# EAGLE design BusPirate-v3.6a (EAGLE 7.4.0)
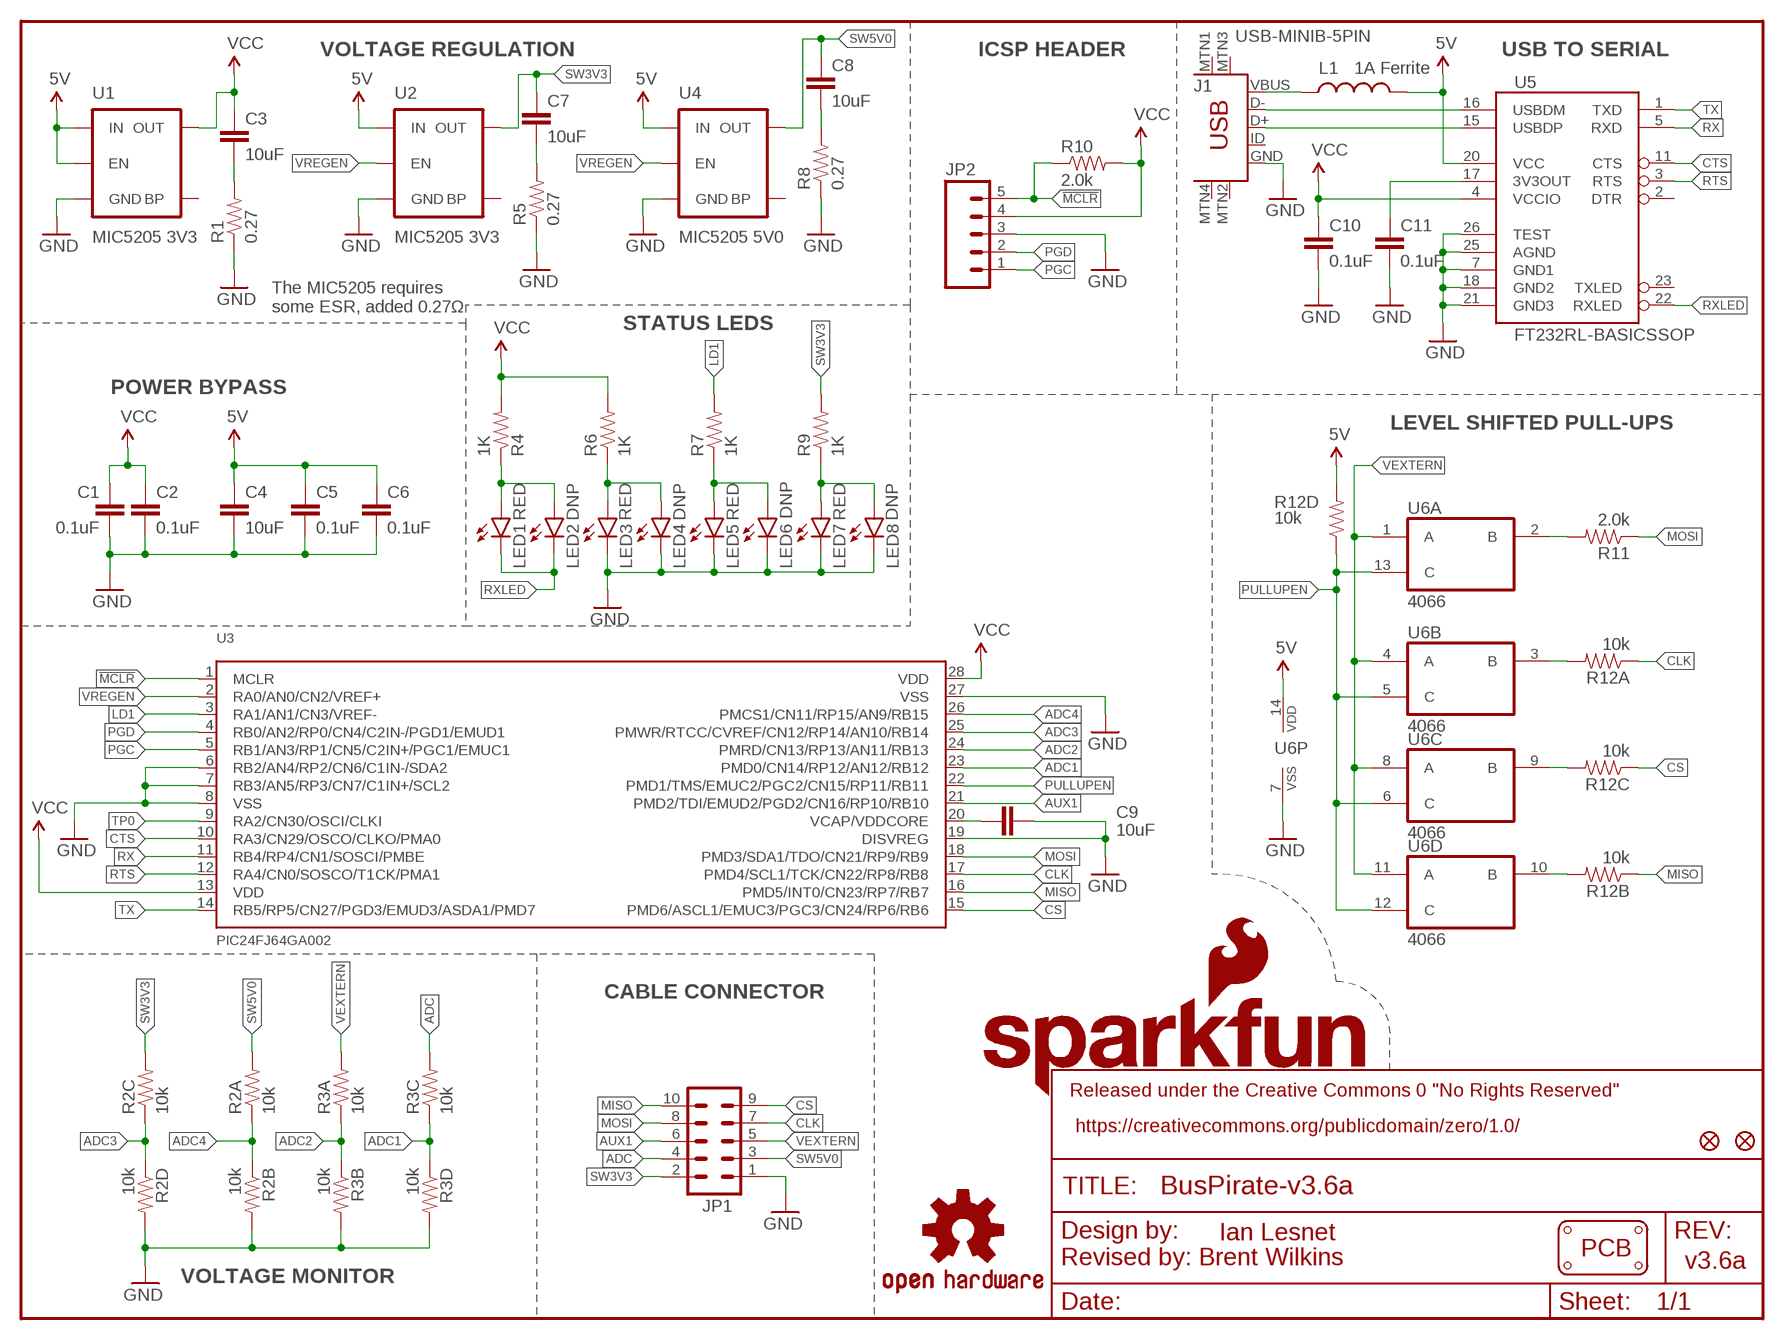
[diagram p0: schematic, sheet 1]

## Parts
C1  0.1uF  0.1UF-25V(+80/-20%)(0603)  [0603-CAP]
C2  0.1uF  0.1UF-25V(+80/-20%)(0603)  [0603-CAP]
C3  10uF  10UF10V10%(0805)  [0805-CAP]
C4  10uF  10UF10V10%(0805)  [0805-CAP]
C5  0.1uF  0.1UF-25V(+80/-20%)(0603)  [0603-CAP]
C6  0.1uF  0.1UF-25V(+80/-20%)(0603)  [0603-CAP]
C7  10uF  10UF10V10%(0805)  [0805-CAP]
C8  10uF  10UF10V10%(0805)  [0805-CAP]
C9  10uF  10UF10V10%(0805)  [0805-CAP]
C10  0.1uF  0.1UF-25V(+80/-20%)(0603)  [0603-CAP]
C11  0.1uF  0.1UF-25V(+80/-20%)(0603)  [0603-CAP]
FID1  FIDUCIAL1X2  [FIDUCIAL-1X2]
FID2  FIDUCIAL1X2  [FIDUCIAL-1X2]
J1  USB-MINIB-5PIN  [USB-MINIB]
JP1  M05X2SHD_SMD  [2X5-SHROUDED_SMD]
JP2  M05PTH  [1X05]
L1  1A Ferrite  INDUCTOR0603  [0603]
LED1  RED  LED-RED0603  [LED-0603]
LED2  DNP  LED-RED0603  [LED-0603]
LED3  RED  LED-RED0603  [LED-0603]
LED4  DNP  LED-RED0603  [LED-0603]
LED5  RED  LED-RED0603  [LED-0603]
LED6  DNP  LED-RED0603  [LED-0603]
LED7  RED  LED-RED0603  [LED-0603]
LED8  DNP  LED-RED0603  [LED-0603]
LOGO1  OSHW-LOGOL  [OSHW-LOGO-L]
LOGO2  SFE_LOGO_NAME_FLAME.1_INCH  [SFE_LOGO_NAME_FLAME_.1]
PCB1  PCB_DP_RECTANGLE-37X60  [DP6037_V1]
R1  0.27  0OHM-1/10W-5%(0603)  [0603]
R2  10k  CAY16-F4  [4XARRAY]
R3  10k  CAY16-F4  [4XARRAY]
R4  1K  1KOHM-1/10W-1%(0603)  [0603-RES]
R5  0.27  0OHM-1/10W-5%(0603)  [0603]
R6  1K  1KOHM-1/10W-1%(0603)  [0603-RES]
R7  1K  1KOHM-1/10W-1%(0603)  [0603-RES]
R8  0.27  0OHM-1/10W-5%(0603)  [0603]
R9  1K  1KOHM-1/10W-1%(0603)  [0603-RES]
R10  2.0k  2.0KOHM1/10W5%(0603)  [0603-RES]
R11  2.0k  2.0KOHM1/10W5%(0603)  [0603-RES]
R12  10k  CAY16-F4  [4XARRAY]
U1  MIC5205 3V3  MIC52053.3V  [SOT23-5]
U2  MIC5205 3V3  MIC52053.3V  [SOT23-5]
U3  PIC24FJ64GA002  [SSOP28]
U4  MIC5205 5V0  MIC52055V  [SOT23-5]
U5  FT232RL-BASICSSOP  [SSOP28DB]
U6  4066  [TSSOP14]

## Nets
5V: C4.1 C5.1 C6.1 L1.2 R12.5 U1.1(IN) U1.3(EN) U2.1(IN) U4.1(IN) U5.20(VCC) U6.14(P:VDD)
!MCLR: JP2.5 R10.1 U3.1(MCLR)
$N26: J1.VBUS L1.1
ADC: JP1.4 R3.6
ADC1: R3.3 R3.4 U3.23(PMD0/CN14/RP12/AN12/RB12)
ADC2: R3.1 R3.2 U3.24(PMRD/CN13/RP13/AN11/RB13)
ADC3: R2.3 R2.4 U3.25(PMWR/RTCC/CVREF/CN12/RP14/AN10/RB14)
ADC4: R2.1 R2.2 U3.26(PMCS1/CN11/RP15/AN9/RB15)
AUX1: JP1.6 U3.21(PMD2/TDI/EMUD2/PGD2/CN16/RP10/RB10)
CLK: JP1.7 R12.1 U3.17(PMD4/SCL1/TCK/CN22/RP8/RB8)
CS: JP1.9 R12.3 U3.15(PMD6/ASCL1/EMUC3/PGC3/CN24/RP6/RB6)
CTS: U3.10(RA3/CN29/OSCO/CLKO/PMA0) U5.11(CTS)
D+: J1.D+ U5.15(USBDP)
D-: J1.D- U5.16(USBDM)
GND: C1.2 C2.2 C4.2 C5.2 C6.2 C9.2 C10.2 C11.2 J1.GND JP1.1 JP2.3 LED3.C LED4.C LED5.C LED6.C LED7.C LED8.C R1.1 R2.5 R2.7 R3.5 R3.7 R5.1 R8.1 U1.2(GND) U2.2(GND) U3.6(RB2/AN4/RP2/CN6/C1IN-/SDA2) U3.7(RB3/AN5/RP3/CN7/C1IN+/SCL2) U3.8(VSS) U3.19(DISVREG) U3.27(VSS) U4.2(GND) U5.7(GND1) U5.18(GND2) U5.21(GND3) U5.25(AGND) U5.26(TEST) U6.7(P:VSS)
LD1: R7.2 U3.3(RA1/AN1/CN3/VREF-)
MISO: JP1.10 R12.2 U3.16(PMD5/INT0/CN23/RP7/RB7)
MOSI: JP1.8 R11.1 U3.18(PMD3/SDA1/TDO/CN21/RP9/RB9)
N$1: R11.2 U6.2(A:B)
N$2: R12.6 U6.9(C:B)
N$3: C9.1 U3.20(VCAP/VDDCORE)
N$4: R12.7 U6.10(D:B)
N$5: R12.8 U6.3(B:B)
N$6: LED5.A LED6.A R7.1
N$7: LED3.A LED4.A R6.1
N$8: C3.2 R1.2
N$9: C11.1 U5.17(3V3OUT)
N$10: C7.2 R5.2
N$11: C8.2 R8.2
N$13: LED1.A LED2.A R4.1
N$18: LED7.A LED8.A R9.1
PGC: JP2.1 U3.5(RB1/AN3/RP1/CN5/C2IN+/PGC1/EMUC1)
PGD: JP2.2 U3.4(RB0/AN2/RP0/CN4/C2IN-/PGD1/EMUD1)
PULLUPEN: R12.4 U3.22(PMD1/TMS/EMUC2/PGC2/CN15/RP11/RB11) U6.5(B:C) U6.6(C:C) U6.12(D:C) U6.13(A:C)
RTS: U3.12(RA4/CN0/SOSCO/T1CK/PMA1) U5.3(RTS)
RX: U3.11(RB4/RP4/CN1/SOSCI/PMBE) U5.5(RXD)
RXLED: LED1.C LED2.C U5.22(RXLED)
SW3V3: C7.1 JP1.2 R2.6 R9.2 U2.5(OUT)
SW5V0: C8.1 JP1.3 R2.8 U4.5(OUT)
TP0: U3.9(RA2/CN30/OSCI/CLKI)
TX: U3.14(RB5/RP5/CN27/PGD3/EMUD3/ASDA1/PMD7) U5.1(TXD)
VCC: C1.1 C2.1 C3.1 C10.1 JP2.4 R4.2 R6.2 R10.2 U1.5(OUT) U3.13(VDD) U3.28(VDD) U5.4(VCCIO)
VEXTERN: JP1.5 R3.8 U6.1(A:A) U6.4(B:A) U6.8(C:A) U6.11(D:A)
VREGEN: U2.3(EN) U3.2(RA0/AN0/CN2/VREF+) U4.3(EN)
Unconnected: J1.ID J1.MTN1(MTN2) J1.MTN2(MTN3) J1.MTN3(MTN1) J1.MTN4 U1.4(BP) U2.4(BP) U4.4(BP) U5.2(DTR) U5.23(TXLED)

## Notes on the sheet
- VOLTAGE REGULATION | ICSP HEADER | USB TO SERIAL
- The MIC5205 requires
  some ESR, added 0.27Ω
- STATUS LEDS
- POWER BYPASS
- LEVEL SHIFTED PULL-UPS
- CABLE CONNECTOR
- Released under the Creative Commons 0 "No Rights Reserved"
- https://creativecommons.org/publicdomain/zero/1.0/
- TITLE:
- Design by: | Ian Lesnet | REV:
- Revised by: Brent Wilkins | v3.6a
- VOLTAGE MONITOR
- Date: | Sheet:

## Library data of the parts
C1 C2 C5 C6 C10 C11 = SparkFun-Capacitors:0.1UF-25V(+80/-20%)(0603): CAP-00810 Ceramic Standard decoupling cap; PROD_ID: CAP-00810
C3 C4 C7-C9 = SparkFun-Capacitors:10UF10V10%(0805): CAP-11330; PROD_ID: CAP-11330
FID1 FID2 = SparkFun-Aesthetics:FIDUCIAL: Fiducial Alignment Points Various fiducial points for machine vision alignment.
J1 = SparkFun-Connectors:USB-MINIB: Mini-USB "B" connector with 5th pin broken out. Created new symbol breaking out 5th "ID" pin in mini/micro USB connector spec. See: http://en.wikipedia.org/wiki/Mini_usb#Cables. Uses same footprint as 4-pin symbol. Also added pins to connect to mounting / shield pads if required (probably not generally needed as signals aren't shielded once they leave the connector).; PROD_ID: CONN-08193
JP1 = SparkFun-Connectors:M05X2: Header 5x2 Standard 10-pin dual row 0.1" header. Commonly used with AVR-ISP. Use with Spark Fun Electronics SKU: PRT-00778; PROD_ID: CONN-09508
JP2 = SparkFun-Connectors:M05: Header 5 Standard 5-pin 0.1" header. Use with straight break away headers (SKU : PRT-00116), right angle break away headers (PRT-00553), swiss pins (PRT-00743), machine pins (PRT-00117), and female headers (PRT-00115). Molex polarized connector foot print use with SKU : PRT-08230 with associated crimp pins and housings.
L1 = SparkFun-Passives:INDUCTOR: Inductors Basic Inductor/Choke - 0603 and 1206. Footprints are not proven and vary greatly between part numbers. INDUCTOR POWER 3.3UH 4.0A SMD 0.197" L x 0.197" W x 0.177" H (5.00mm x 5.00mm x 4.50mm); PROD_ID: NDUC-12579
LED1 LED3 LED5 LED7 = SparkFun-LED:LED-RED: Assorted Red LEDs LilyPad 1206- DIO-09912 1206- DIO-00809 0603- DIO-00819 "SMART" means more efficient and expensive; PROD_ID: DIO-00819
LED2 LED4 LED6 LED8 = SparkFun-LED:LED-RED: Assorted Red LEDs LilyPad 1206- DIO-09912 1206- DIO-00809 0603- DIO-00819 "SMART" means more efficient and expensive; PROD_ID: DIO-00819; VALUE: RED
LOGO1 = SparkFun-Aesthetics:OSHW-LOGO: Open Source Hardware Logo This logo indicates the piece of hardware it is found on incorporates a OSHW license and/or adheres to the definition of open source hardware found here: http://freedomdefined.org/OSHW
LOGO2 = SparkFun-Aesthetics:SFE_LOGO_NAME_FLAME: SFE Logo, name and flame This is the SparkFun full logo. The logo on the schematic will always be the same size; the package variant is the height of the flame part of the logo. Default layer for the logo on the board is tSilk.
PCB1 = SparkFun-Boards:PCB_DP_RECTANGLE: Dangerous Prototypes Standard Rectangular PCB sizes
R1 R5 R8 = SparkFun-Resistors:0OHM-1/10W-5%(0603): RES-08609; PROD_ID: RES-08787; VALUE: 0
R2 R3 R12 = Testing:CAY16-F4: CAY16-F4 <http://www.bourns.com/data/global/pdfs/CATCAY.pdf>; PROD_ID: RES-13167
R4 R6 R7 R9 = SparkFun-Resistors:1KOHM-1/10W-1%(0603): RES-07856; PROD_ID: RES-07856
R10 R11 = SparkFun-Resistors:2.0KOHM1/10W5%(0603): RES-08296; PROD_ID: RES-08296
U1 U2 = SparkFun-PowerIC:MIC5205: MIC5205 150mA vreg 3.3V - VREG-00822 5V - VREG-00823; PROD_ID: VREG-00822
U3 = Testing:PIC24FJ64GA002: 16-bit General Purpose Flash Microcontroller; PROD_ID: IC-09426
U4 = SparkFun-PowerIC:MIC5205: MIC5205 150mA vreg 3.3V - VREG-00822 5V - VREG-00823; PROD_ID: VREG-00823
U5 = SparkFun-DigitalIC:FT232RL-BASIC: USB UART This is the simplified version of the FT232RL unit. Only what you need, nothing you don't. Spark Fun Electronics SKU : COM-00650; PROD_ID: IC-00870
U6 = 40xx:4066: Quad bilateral ANALOG SWITCH; PROD_ID: IC-13191

## Board
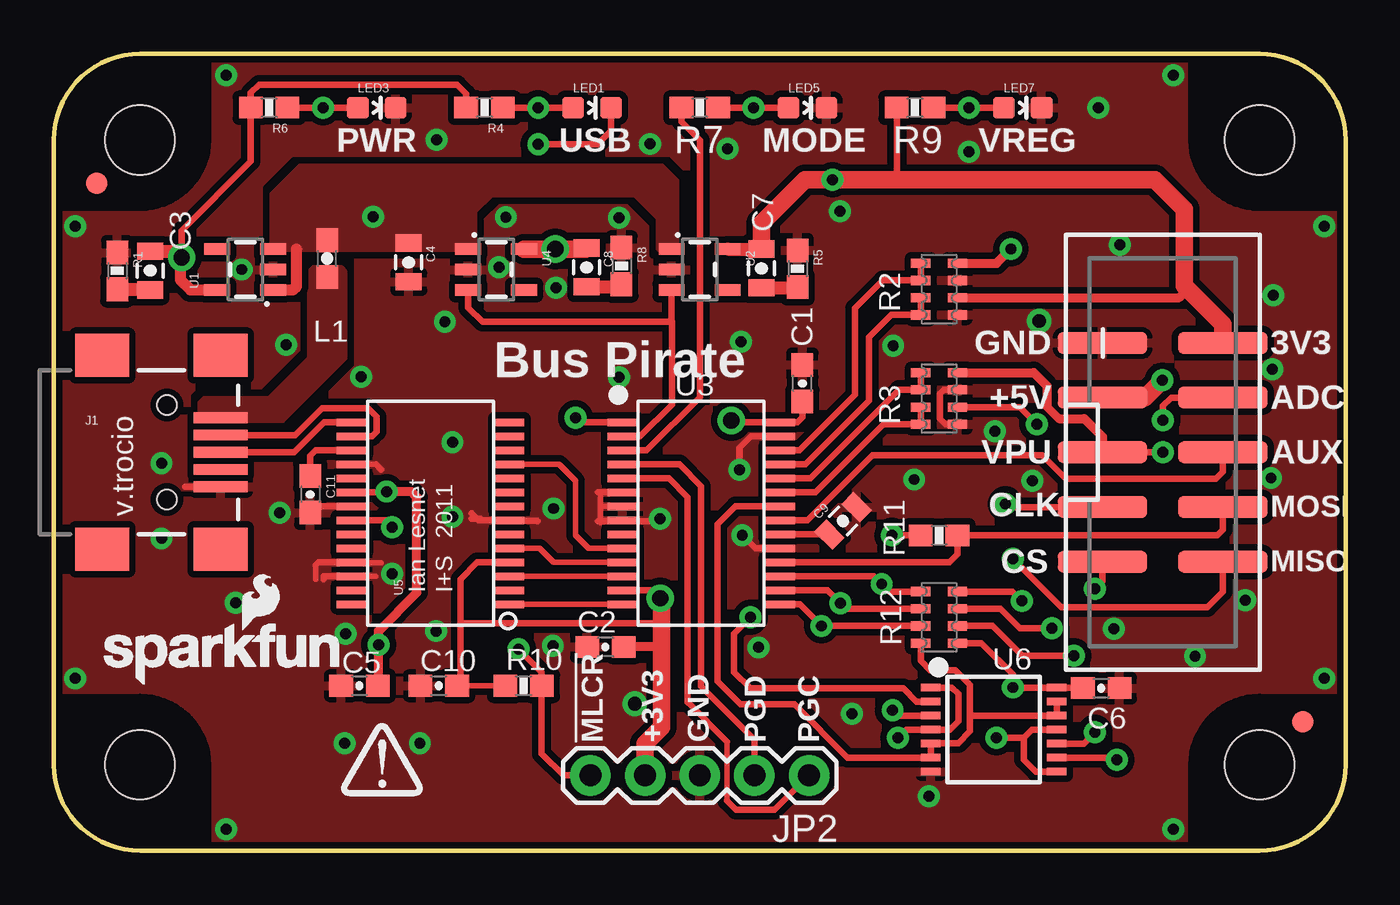
[diagram p1: board, top side]
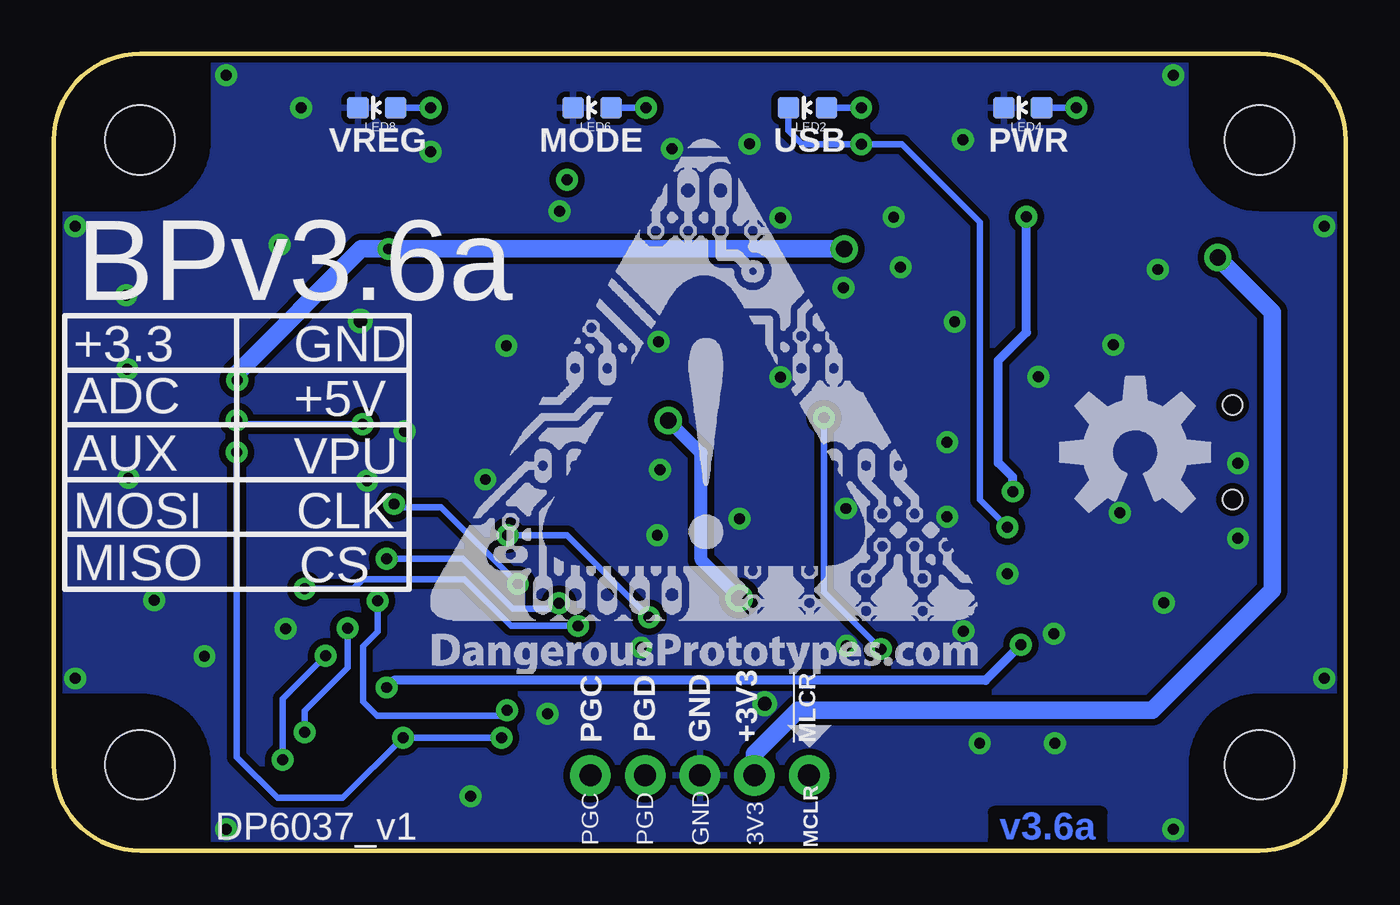
[diagram p2: board, bottom side, seen from below]

Size 60 x 37 mm. Coordinates in mm from the lower left corner, seen from the top.
Copper layers (1*16): Top 0.035mm / dielectric 1.5mm / Bottom 0.035mm
Design rules "SparkFun-2-layer *": minimum track width 7mil, minimum drill 15mil, track to track 8mil, track to pad 8mil, pad to pad 8mil, via to via 8mil, smd to smd 8mil, copper to edge 8mil, drill to drill 8mil, minimum pad ring 12mil, minimum via ring 10mil, stop-mask expansion 4mil, vias tented up to drill 30mil, thermal gap 10mil
tKeepout: 8 lines
bKeepout: 8 lines
tRestrict: area 0,30 to 7,37; area 53,30 to 60,37; area 0,0 to 7,7; area 53,0 to 60,7; area 26.1,16.2 to 26.7,16.4; area 13.6,12.9 to 14.1,13.2
bRestrict: area 0,30 to 7,37; area 53,30 to 60,37; area 0,0 to 7,7; area 53,0 to 60,7
vRestrict: area 0,30 to 7,37; area 53,30 to 60,37; area 0,0 to 7,7; area 53,0 to 60,7

### Footprints (pad centres in the part's own frame; a part is rotated, then mirrored left to right if it is on the bottom)
0603-CAP = smd 1.1 x 1: 1 -0.85,0; 2 0.85,0
0805-CAP = smd 0.8 x 1.2: 1 -0.9,0; 2 0.9,0
FIDUCIAL-1X2 = smd 1 x 1: 1 0,0
USB-MINIB = smd 2.5 x 0.5: D+ 2.5,0; D- 2.5,0.8; GND 2.5,-1.6; ID 2.5,-0.8; VBUS 2.5,1.6 | smd 2.5 x 2: MTN1 -3,4.5; MTN2 2.5,4.5; MTN3 -3,-4.5; MTN4 2.5,-4.5 | hole 0.9: 0,2.2; 0,-2.2
2X5-SHROUDED_SMD = smd 4.15 x 1: 1 -2.794,5.08; 2 2.794,5.08; 3 -2.794,2.54; 4 2.794,2.54; 5 -2.794,0; 6 2.794,0; 7 -2.794,-2.54; 8 2.794,-2.54; 9 -2.794,-5.08; 10 2.794,-5.08
1X05 = drill 1.016 pad 1.88: 1 0,0; 2 2.54,0; 3 5.08,0; 4 7.62,0; 5 10.16,0
0603 = smd 1.1 x 1: 1 -0.85,0; 2 0.85,0
LED-0603 = smd 1 x 1: A 0,-0.877; C 0,0.877
DP6037_V1 = hole 3.2: 4,4; 56,4; 56,33; 4,33
4XARRAY = smd 0.425 x 0.9: 1 -1.2,-0.85; 2 -0.4,-0.85; 3 0.4,-0.85; 4 1.2,-0.85; 5 1.2,0.85; 6 0.4,0.85; 7 -0.4,0.85; 8 -1.2,0.85
0603-RES = smd 1.1 x 1: 1 -0.85,0; 2 0.85,0
SOT23-5 = smd 0.55 x 1.2: 1 -0.95,-1.3; 2 0,-1.3; 3 0.95,-1.3; 4 0.95,1.3; 5 -0.95,1.3
SSOP28 = smd 0.348 x 1.397: 1 -4.225,-3.656; 2 -3.575,-3.656; 3 -2.925,-3.656; 4 -2.275,-3.656; 5 -1.625,-3.656; 6 -0.975,-3.656; 7 -0.325,-3.656; 8 0.325,-3.656; 9 0.975,-3.656; 10 1.625,-3.656; 11 2.275,-3.656; 12 2.925,-3.656; 13 3.575,-3.656; 14 4.225,-3.656; 15 4.225,3.656; 16 3.575,3.656; 17 2.925,3.656; 18 2.275,3.656; 19 1.625,3.656; 20 0.975,3.656; 21 0.325,3.656; 22 -0.325,3.656; 23 -0.975,3.656; 24 -1.625,3.656; 25 -2.275,3.656; 26 -2.925,3.656; 27 -3.575,3.656; 28 -4.225,3.656
SSOP28DB = smd 0.348 x 1.397: 1 -4.225,-3.656; 2 -3.575,-3.656; 3 -2.925,-3.656; 4 -2.275,-3.656; 5 -1.625,-3.656; 6 -0.975,-3.656; 7 -0.325,-3.656; 8 0.325,-3.656; 9 0.975,-3.656; 10 1.625,-3.656; 11 2.275,-3.656; 12 2.925,-3.656; 13 3.575,-3.656; 14 4.225,-3.656; 15 4.225,3.656; 16 3.575,3.656; 17 2.925,3.656; 18 2.275,3.656; 19 1.625,3.656; 20 0.975,3.656; 21 0.325,3.656; 22 -0.325,3.656; 23 -0.975,3.656; 24 -1.625,3.656; 25 -2.275,3.656; 26 -2.925,3.656; 27 -3.575,3.656; 28 -4.225,3.656
TSSOP14 = smd 0.35 x 0.9: 1 -1.95,-2.925; 2 -1.3,-2.925; 3 -0.65,-2.925; 4 0,-2.925; 5 0.65,-2.925; 6 1.3,-2.925; 7 1.95,-2.925; 8 1.95,2.925; 9 1.3,2.925; 10 0.65,2.925; 11 0,2.925; 12 -0.65,2.925; 13 -1.3,2.925; 14 -1.95,2.925

### Placement (x,y rotation side)
C1  34.77,21.7 90 top
C2  25.62,9.46 180 top
C3  4.47,26.94 270 top
C4  16.48,27.32 270 top
C5  14.19,7.66 180 top
C6  48.65,7.55 0 top
C7  32.86,27.04 270 top
C8  24.74,27.09 270 top
C9  36.65,15.32 45 top
C10  17.88,7.66 180 top
C11  11.91,16.55 270 top
FID1  2,31 0 top
FID2  58,6 0 top
J1  5.25,18.5 0 top
JP1  51.5,18.5 0 top
JP2  35.08,3.5 180 top
L1  12.7,27.5 90 top
LED1  25,34.5 270 top
LED2  25,34.5 90 bottom
LED3  15,34.5 270 top
LED4  15,34.5 90 bottom
LED5  35,34.5 270 top
LED6  35,34.5 90 bottom
LED7  45,34.5 270 top
LED8  45,34.5 90 bottom
LOGO1  9.78,18.5 0 bottom
LOGO2  1.91,7.62 0 top
PCB1  0,0 0 top
R1  2.95,26.92 270 top
R2  41.12,26.08 270 top
R3  41.12,21 270 top
R4  20,34.5 180 top
R5  34.54,27.03 270 top
R6  10,34.5 180 top
R7  30,34.5 180 top
R8  26.37,27.15 270 top
R9  40,34.5 180 top
R10  21.81,7.66 180 top
R11  41.12,14.65 180 top
R12  41.12,10.84 270 top
U1  8.89,26.99 90 top
U2  30,26.99 270 top
U3  30.07,15.66 270 top
U4  20.54,26.99 270 top
U5  17.5,15.66 90 top
U6  43.66,5.63 270 top
U$1  [DP-LOGO]  13.34,2.54 0 top
U$3  [DP_LOGO_ART_1X1]  42.49,8.24 0 bottom

### Tracks (layer width: path | path; a pad name or v marks a point on that pad's centre or on a via)
5V  (via drill 0.51)
  Top 0.305: U5.20 15.42,16.64 v15.46,16.68 | R12.5 43.08,9.64 44.53,8.19 44.53,7.59 v44.55,7.58 U6.14 47.77,7.58 C6.1
  Top 0.406: C5.1 15.08,7.7 v15.08,9.57 15.08,10.2 16.86,11.98 16.86,16.43 16.61,16.68 v15.46,16.68
  Top 0.508: U1.1 11.12,26.04 11.27,26.19 11.27,27.94
  Bottom 0.406: v15.08,9.57 16.73,7.92 44.21,7.92 v44.55,7.58 | v15.46,16.68 15.46,17.34 16.14,18.02 16.14,22.77 14.83,24.07 v14.83,29.44
  pour Top (isolate 0.203, no thermals): 10.16,30.48 10.16,27.94 19.53,27.94 19.53,29.69 20.32,30.48 26.99,30.48 28.1,29.37 28.1,27.94 28.89,27.94 28.89,31.11 28.26,31.75 11.43,31.75
!MCLR  (via drill 0.51)
  Top 0.305: U3.1 24.45,19.89 v24.23,20.11 | JP2.5 23.67,3.5 22.66,4.51 R10.1 22.66,8.29 v21.59,9.37
  Bottom 0.305: v24.23,20.11 24.23,12 v21.59,9.37
$N26
  pour Top (isolate 0.305, no thermals): 6.83,20 6.83,20.8 6.99,20.95 10,20.95 11.91,22.86 11.91,26.89 12.06,27.05 13.34,27.05 13.49,26.89 13.49,22.86 10.64,20
ADC  (via drill 0.51)
  Top 0.305: R3.6 44.87,20.6 v45.66,19.8 | v51.51,19.99 51.51,20.65 51.9,21.04 JP1.4
  Bottom 0.305: v45.66,19.8 51.32,19.8 v51.51,19.99
ADC1
  Top 0.305: R3.3 R3.4 38.54,19.8 35.38,16.64 U3.23
ADC2
  Top 0.305: R3.1 R3.2 39.25,21.4 35.14,17.29 U3.24
ADC3
  Top 0.305: R2.3 R2.4 38.9,24.88 37.85,23.83 37.85,20.89 34.91,17.94 U3.25
ADC4
  Top 0.305: U3.26 34.64,18.59 37.22,21.16 37.22,25.18 38.52,26.48 R2.2 R2.1
AUX1
  Top 0.305: U3.21 35,15.34 38.02,18.36 45.91,18.36 47,17.27 53.97,17.27 54.29,17.59 JP1.6
CLK  (via drill 0.51)
  Top 0.305: U3.17 38.1,12.74 v38.45,12.39 | v38.45,12.39 38.7,12.13 | R12.1 38.8,12.04 v38.45,12.39 | v44.2,16.1 44.34,15.96 JP1.7
  Bottom 0.305: v38.45,12.39 42.02,15.96 44.06,15.96 v44.2,16.1
CS  (via drill 0.51)
  Top 0.305: v35.66,10.44 R12.3 | v35.66,10.44 35.8,10.44 | v35.66,10.44 34.66,11.44 U3.15 | v48.35,12.16 48.71,12.52 JP1.9
  Bottom 0.305: v35.66,10.44 38.76,10.44 40.94,12.62 45.64,12.62 46.09,12.16 v48.35,12.16
CTS
  Top 0.254: U5.11 23.48,17.94 24.23,17.19 24.23,14.65 24.84,14.04 U3.10
D+
  Top 0.305: U5.15 12.55,19.89 11.93,19.26 11.92,19.26 11.16,18.5 J1.D+
D-
  Top 0.305: 13.85,19.25 U5.16 14.79,19.24 15,19.45 15,20.15 14.6,20.55 12.45,20.55 11.2,19.3 J1.D-
GND  (via drill 0.51, 0.64)
  Top 0.254: 14.97,17.94 U5.18 | 12.16,12.62 12.16,13.25 | 13.69,13.38 15.21,13.38 | 14.96,12.74 13.81,12.74 13.82,12.74 U5.26 | U3.6 25.4,16.64 25.4,15.34 | U3.8 25.4,15.34 | 25.4,15.34 25.4,15.24 | U3.7 25.4,15.99 25.4,15.34
  Top 0.305: 19.73,15.34 19.8,15.41 19.65,15.41 | 19.65,15.41 19.4,15.41 | 19.73,15.34 U5.7 | 19.65,15.41 19.4,15.66 | 19.65,15.41 19.73,15.34 | 15.21,17.7 14.97,17.94 | U5.25 12.3,13.39 12.16,13.25 | U5.26 12.54,12.74 12.54,12.62 | v31.85,17.7 31.85,18.71 32.37,19.24 U3.27 33.6,19.24 | U3.19 32.58,14.04 v31.97,14.65 | 25.27,15.31 28.06,15.31 | 20.92,15.33 22.45,15.33 22.47,15.31 | U5.21 12.19,15.99 C11.2 | J1.GND 6.1,16.9 | R3.5 41.42,19.8 41.15,20.07 41.15,21.21 41.34,21.4 R3.7 | U3.6 25.27,16.64
  other vias: 20.67,27.09 8.73,26.99 8,1 13.5,5 17,5 1,8 52,1 59,8 55.34,11.62 56.53,17.31 56.59,22.36 56.64,25.8 59,29 49.5,28.13 36.51,29.69 42.5,32.45 52,36 31.29,32.59 17.78,33.02 18.51,18.96 18.51,15.51 17.75,10.2 13.56,10.07 8.45,11.52 10.48,15.69 10.79,23.5 14.27,22.01 32.73,9.44 15.72,12.87 53,9.03 40.64,2.54 45.45,17.19 49.23,10.3 43.7,19.47 23.21,15.89 28.16,15.41 37.06,6.37 38.98,23.45 31.92,23.63 26.26,21.99 1,29 8,36 48.51,34.5 45.77,24.6 26.99,6.83 18.16,24.55 23.33,26.14 26.26,29.39 20.99,29.42 23.18,9.53 5,14.5 5,18 27.69,32.82 39.96,17.24
  pour Top (isolate 0.305, rank 6): 0,37 60,37 60,0 0,0
  pour Bottom (isolate 0.305): 0,37 60,37 60,0 0,0
LD1
  Top 0.305: U3.3 27.53,18.59 30,21.06 30,33 29.15,33.85 R7.2
MISO  (via drill 0.51)
  Top 0.305: U3.16 35.93,12.09 v36.53,11.49 | v36.53,11.49 36.42,11.6 | v36.53,11.49 36.78,11.24 R12.2 | JP1.10 54.29,12.02 53.57,11.3 46.79,11.3 v44.54,13.55
  Bottom 0.305: v36.53,11.49 36.78,11.24 38.67,11.24 40.98,13.55 v44.54,13.55
MOSI
  Top 0.305: U3.18 41.59,13.39 41.97,13.77 R11.1 54.05,14.65 54.3,14.9 JP1.8
N$1  (via drill 0.51)
  Top 0.305: v38.93,14.65 R11.2 | U6.2 40.07,6.93 39.47,7.54 32.35,7.54 31.59,8.3 31.59,10.07 v32.35,10.84
  Bottom 0.305: v38.93,14.65 36.16,14.65 v32.35,10.84
N$2  (via drill 0.51)
  Top 0.305: U6.9 49.27,4.33 v49.37,4.23 | R12.6 43.6,10.44 44.98,9.06 v47.37,9.06
  Bottom 0.305: v47.37,9.06 49.37,7.06 v49.37,4.23
N$3
  Top 0.305: U3.20 35.87,14.69 | 35.87,14.69 C9.1 | C9.1 35.87,14.68 35.87,14.69
N$4  (via drill 0.51)
  Top 0.305: U6.10 47.83,4.98 v48.36,5.5 | v46.36,10.33 44.88,10.33 43.97,11.24 R12.7
  Bottom 0.305: v46.36,10.33 46.36,8.49 48.36,6.5 v48.36,5.5
N$5  (via drill 0.51)
  Top 0.305: U6.3 39.2,6.28 v38.96,6.52 | R12.8 44.53,12.04 v44.97,11.6
  Bottom 0.305: v38.96,6.52 39.21,6.26 44.98,6.26 45.62,6.92 45.62,9.51 44.97,10.16 v44.97,11.6
N$6  (via drill 0.51)
  Top 0.305: R7.1 v32.5,34.5 LED6.A
  Bottom 0.305: v32.5,34.5 LED6.A
N$7  (via drill 0.51)
  Top 0.305: R6.1 v12.5,34.5 LED4.A
  Bottom 0.305: v12.5,34.5 LED4.A
N$8
  Top 0.61: R1.2 4.47,26.07 C3.2
N$9
  Top 0.305: U5.17 12.16,18.59 11.91,18.33 C11.1
N$10
  Top 0.61: C7.2 34.54,26.14 R5.2
N$11
  Top 0.61: C8.2 26.25,26.19 R8.2
N$13  (via drill 0.51)
  Top 0.305: R4.1 v22.5,34.5 LED2.A
  Bottom 0.305: v22.5,34.5 LED2.A
N$18  (via drill 0.51)
  Top 0.305: R9.1 v42.5,34.5 LED8.A
  Bottom 0.305: v42.5,34.5 LED8.A
PGC
  Top 0.251: 31.27,2.34 31.27,5.06
  Top 0.305: U3.5 28.57,17.29 29.43,16.43 29.43,6.88 29.45,6.88 31.27,5.06 | JP2.1 33.48,1.9 31.69,1.9 31.27,2.32 31.27,2.34
PGD
  Top 0.305: U3.4 29.06,17.94 30.07,16.93 30.07,7.63 32.54,5.16 JP2.2
PULLUPEN
  Top 0.305: 42.55,6.26 42.55,5.54 42.01,5 40.75,5 U6.5 U6.6 36.87,4.33 34.4,6.8 31.9,6.8 30.83,7.87 30.83,15.15 31.66,15.99 U3.22 | 42.55,6.26 42.57,6.28 U6.12 U6.13 | 42.55,6.26 42.55,7.7 41.87,8.39 40.7,8.39 40.27,8.82 R12.4
RTS
  Top 0.254: U5.3 U3.12
RX
  Top 0.254: U5.5 22.55,14.04 23.2,13.39 U3.11
RXLED  (via drill 0.51)
  Top 0.305: U5.22 15.41,15.34 v15.72,15.03 | v22.5,32.8 25.26,32.8 25.88,33.42 LED2.C
  Bottom 0.305: v15.72,15.03 16.99,16.3 16.99,29.19 20.6,32.8 v22.5,32.8 25.26,32.8 25.88,33.42 LED2.C
SW3V3  (via drill 0.51)
  Top 0.305: 44.55,31.22 44.48,31.22 44.55,31.16 | 38.9,31.16 39.15,31.41 R9.2
  Top 0.406: R2.6 52.27,25.68 52.67,26.07
  Top 0.61: U2.5 C7.1 | C7.1
  Top 0.813: C7.1 32.86,29.12 34.89,31.16 v36.16,31.16 38.9,31.16 44.55,31.16 51.14,31.16 52.5,29.79 52.5,26.24 52.67,26.07 54.29,24.45 JP1.2
SW5V0  (via drill 0.51, 0.76)
  Top 0.305: 23.45,27.94 23.33,27.94 | v23.3,27.94 v23.29,27.94
  Top 0.406: R2.8 43.79,27.28 v44.45,27.94
  Top 0.813: U4.5 v23.29,27.94 23.45,27.94 24.69,27.94 C8.1 | v51.49,21.84 50.68,21.04 JP1.3
  Bottom 0.813: v23.3,27.94 v44.45,27.94 45.72,27.94 51.49,22.17 v51.49,21.84
TX
  Top 0.254: U5.1 U3.14
VCC  (via drill 0.76)
  Top 0.254: C10.1 R10.2
  Top 0.305: v31.46,19.98 31.56,19.89 U3.28 34.54,19.89 34.77,20.12 C1.1 | 28.23,10.57 18.89,10.57 | 18.89,10.57 18.89,7.83 C10.1 | U5.4 19.66,13.39 18.89,12.62 18.89,10.57 | U3.13 27.8,12.09 v28.16,11.73 | R4.2 19.15,35.14 18.73,35.56 9.53,35.56 9.15,35.19 R6.2 9.15,32.01 5.94,28.8 v5.94,27.54
  Top 0.406: C2.1 28.1,9.46 28.23,9.34
  Top 0.508: U1.5 6.35,26.04 5.87,26.51 5.87,27.47 v5.94,27.54
  Top 0.61: 28.23,11.66 v28.16,11.73 | C3.1 5.94,27.84 v5.94,27.54
  Top 0.813: 28.23,11.66 28.23,10.57 28.23,9.34 28.23,5.73 27.46,4.96 JP2.4
  Bottom 0.61: v28.16,11.73 29.94,13.5 29.94,18.46 v31.46,19.98
  Bottom 0.813: v5.94,27.54 3.41,25.01 3.41,12.1 8.99,6.52 25.44,6.52 27.46,4.5 JP2.4
VEXTERN  (via drill 0.51)
  Top 0.305: U6.8 45.61,3.68 45.05,4.23 45.05,5.25 | U6.11 45.44,5.63 45.05,5.25 | U6.1 41.71,7.58 42.01,7.28 42.01,6.01 41.62,5.63 U6.4 39.59,5.63 v39.21,5.25 | v43.78,5.25 45.05,5.25 | v51.5,18.5 JP1.5
  Top 0.381: 46.13,20.62 46.69,20.07
  Top 0.406: R3.8 45.52,22.2 46.13,21.59 46.13,20.62 | 46.69,20.07 47.85,20.07 48.71,19.21 JP1.5
  Bottom 0.305: v39.21,5.25 v43.78,5.25 46.58,2.46 49.61,2.46 51.5,4.35 v51.5,18.5
VREGEN
  Top 0.305: U3.2 27.23,19.24 28.7,20.71 28.7,24.55 | 28.7,24.55 19.91,24.55 19.24,25.22 U4.3 | U2.3 28.7,24.55 | 28.7,24.55

### Text on the board
Bottom: v3.6a
tPlace: PWR | USB | MODE | VREG | GND | 3V3 | Bus Pirate | +5V | ADC | VPU | AUX | CLK | MOSI | CS | MISO | !MLCR | +3V3 | GND | PGD | PGC
bPlace: PWR | USB | MODE | VREG | !MLCR | +3V3 | GND | PGD | PGC
tNames: v.trocio | 2011 | Ian Lesnet | I+S
bNames: BPv3.6a | GND | +3.3 | +5V | ADC | VPU | AUX | CLK | MOSI | MISO | CS | MCLR | 3V3 | GND | PGD | PGC
Measures: All units in mm
Reference: I/O header | Programming Header
tDocu: Released under the Creative Commons 0 "No Rights Reserved" | https://creativecommons.org/publicdomain/zero/1.0/ | Designed by: Ian Lesnet http://dangerousprototypes.com | Revised by: Brent Wilkins (Based on BP v3.6a)